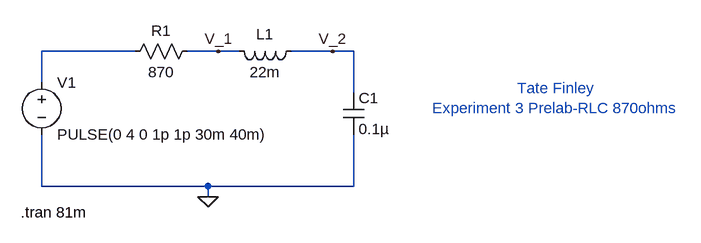
[diagram p0: schematic ECE3060_Experiment3_870ohm_series.asc]
ECE3060_Experiment3_870ohm_series.asc, the LTspice schematic file:
Version 4
SHEET 1 880 680
WIRE -96 80 -240 80
WIRE 32 80 -16 80
WIRE 64 80 32 80
WIRE 208 80 144 80
WIRE 240 80 208 80
WIRE -240 128 -240 80
WIRE 240 144 240 80
WIRE -240 288 -240 208
WIRE 16 288 -240 288
WIRE 240 288 240 208
WIRE 240 288 16 288
WIRE 16 304 16 288
FLAG 16 304 0
FLAG 32 80 V_1
FLAG 208 80 V_2
SYMBOL voltage -240 112 R0
WINDOW 123 0 0 Left 0
WINDOW 39 0 0 Left 0
SYMATTR InstName V1
SYMATTR Value PULSE(0 4 0 1p 1p 30m 40m)
SYMBOL res 0 64 R90
WINDOW 0 0 56 VBottom 2
WINDOW 3 32 56 VTop 2
SYMATTR InstName R1
SYMATTR Value 870
SYMBOL ind 160 64 R90
WINDOW 0 5 56 VBottom 2
WINDOW 3 32 56 VTop 2
SYMATTR InstName L1
SYMATTR Value 22m
SYMBOL cap 224 144 R0
SYMATTR InstName C1
SYMATTR Value 0.1µ
TEXT 552 152 Center 2 ;Tate Finley\nExperiment 3 Prelab-RLC 870ohms
TEXT -272 328 Left 2 !.tran 81m

The netlist it stands for:
* ECE3060_Experiment3_870ohm_series.asc
V1 N001 0 PULSE(0 4 0 1p 1p 30m 40m)
R1 V_1 N001 870
L1 V_2 V_1 22m
C1 V_2 0 0.1µ
* Tate Finley
* Experiment 3 Prelab-RLC 870ohms
.tran 81m
.backanno
.end